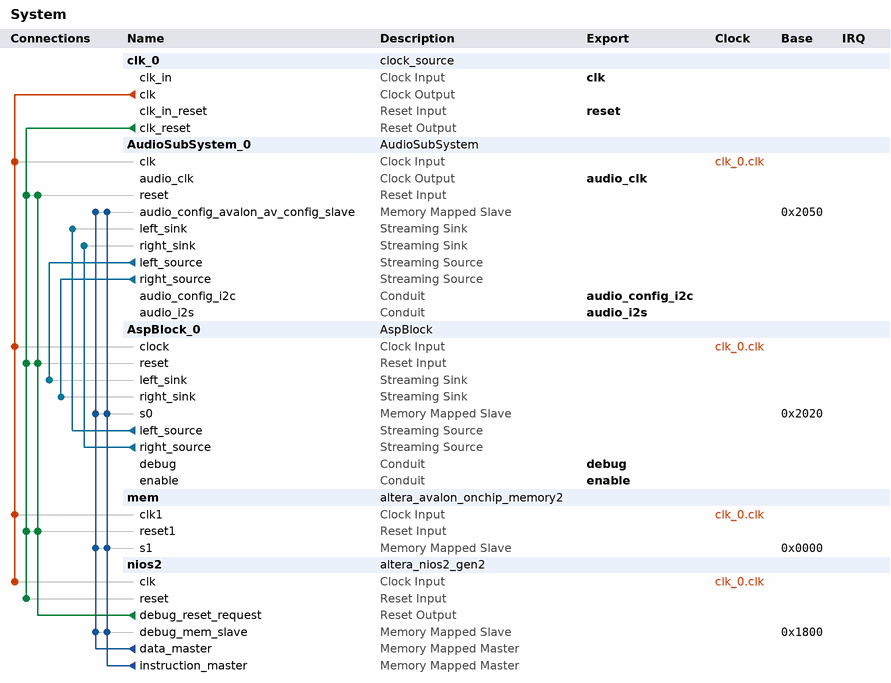
[diagram p0: system contents]
# Platform Designer (Qsys) system System, Cyclone V 5CSEMA5F31C6
# Parameters at their usual value, and those the tool derives, are not listed.
package require -exact qsys 16.1
create_system System
set_project_property DEVICE_FAMILY {Cyclone V}
set_project_property DEVICE 5CSEMA5F31C6

add_instance clk_0 clock_source 16.1
set_instance_parameter_value clk_0 clockFrequency 50000000
set_instance_parameter_value clk_0 resetSynchronousEdges DEASSERT

add_instance AudioSubSystem_0 AudioSubSystem 1.0

add_instance AspBlock_0 AspBlock 1.0
set_instance_parameter_value AspBlock_0 gDataWidth 24

add_instance mem altera_avalon_onchip_memory2 16.1
set_instance_parameter_value mem dataWidth 32
set_instance_parameter_value mem dualPort false
set_instance_parameter_value mem initMemContent true
set_instance_parameter_value mem initializationFileName onchip_mem.hex
set_instance_parameter_value mem memorySize 4096

add_instance nios2 altera_nios2_gen2 16.1
set_instance_parameter_value nios2 dcache_size 2048
set_instance_parameter_value nios2 exceptionSlave mem.s1
set_instance_parameter_value nios2 icache_size 4096
set_instance_parameter_value nios2 impl Tiny
set_instance_parameter_value nios2 resetSlave mem.s1

# connections
add_connection clk_0.clk AspBlock_0.clock clock
add_connection clk_0.clk AudioSubSystem_0.clk clock
add_connection clk_0.clk mem.clk1 clock
add_connection clk_0.clk nios2.clk clock
add_connection clk_0.clk_reset AspBlock_0.reset reset
add_connection clk_0.clk_reset AudioSubSystem_0.reset reset
add_connection clk_0.clk_reset mem.reset1 reset
add_connection clk_0.clk_reset nios2.reset reset
add_connection nios2.debug_reset_request AspBlock_0.reset reset
add_connection nios2.debug_reset_request AudioSubSystem_0.reset reset
add_connection nios2.debug_reset_request mem.reset1 reset
add_connection nios2.data_master AspBlock_0.s0 avalon
set_connection_parameter_value nios2.data_master/AspBlock_0.s0 baseAddress 0x2020
add_connection nios2.data_master AudioSubSystem_0.audio_config_avalon_av_config_slave avalon
set_connection_parameter_value nios2.data_master/AudioSubSystem_0.audio_config_avalon_av_config_slave baseAddress 0x2050
add_connection nios2.data_master mem.s1 avalon
set_connection_parameter_value nios2.data_master/mem.s1 baseAddress 0x0000
add_connection nios2.data_master nios2.debug_mem_slave avalon
set_connection_parameter_value nios2.data_master/nios2.debug_mem_slave baseAddress 0x1800
add_connection nios2.instruction_master AspBlock_0.s0 avalon
set_connection_parameter_value nios2.instruction_master/AspBlock_0.s0 baseAddress 0x2020
add_connection nios2.instruction_master AudioSubSystem_0.audio_config_avalon_av_config_slave avalon
set_connection_parameter_value nios2.instruction_master/AudioSubSystem_0.audio_config_avalon_av_config_slave baseAddress 0x2050
add_connection nios2.instruction_master mem.s1 avalon
set_connection_parameter_value nios2.instruction_master/mem.s1 baseAddress 0x0000
add_connection nios2.instruction_master nios2.debug_mem_slave avalon
set_connection_parameter_value nios2.instruction_master/nios2.debug_mem_slave baseAddress 0x1800
add_connection AspBlock_0.left_source AudioSubSystem_0.left_sink avalon_streaming
add_connection AspBlock_0.right_source AudioSubSystem_0.right_sink avalon_streaming
add_connection AudioSubSystem_0.left_source AspBlock_0.left_sink avalon_streaming
add_connection AudioSubSystem_0.right_source AspBlock_0.right_sink avalon_streaming

# exported interfaces
add_interface audio_clk clock source
set_interface_property audio_clk EXPORT_OF AudioSubSystem_0.audio_clk
add_interface audio_config_i2c conduit end
set_interface_property audio_config_i2c EXPORT_OF AudioSubSystem_0.audio_config_i2c
add_interface audio_i2s conduit end
set_interface_property audio_i2s EXPORT_OF AudioSubSystem_0.audio_i2s
add_interface clk clock sink
set_interface_property clk EXPORT_OF clk_0.clk_in
add_interface debug conduit end
set_interface_property debug EXPORT_OF AspBlock_0.debug
add_interface enable conduit end
set_interface_property enable EXPORT_OF AspBlock_0.enable
add_interface reset reset sink
set_interface_property reset EXPORT_OF clk_0.clk_in_reset

set_interconnect_requirement {$system} qsys_mm.clockCrossingAdapter HANDSHAKE
set_interconnect_requirement {$system} qsys_mm.enableEccProtection FALSE
set_interconnect_requirement {$system} qsys_mm.insertDefaultSlave FALSE
set_interconnect_requirement {$system} qsys_mm.maxAdditionalLatency 1

save_system System.qsys
